# Altium schematic sheet 2_Wheels_H_Bridge.SchDoc: H Bridge
size A4; ApprovedBy: zac1; Author: mmb1; DrawnBy: mmb1; Engineer: mmb1; Organization: Berne University of Applied Sciences; Address1: School of Engineering and; Address2: Information Technology; Address3: Quellgasse 21; Address4: CH-2501 Biel; Revision: 1.0; SheetNumber: 4; SheetTotal: 6
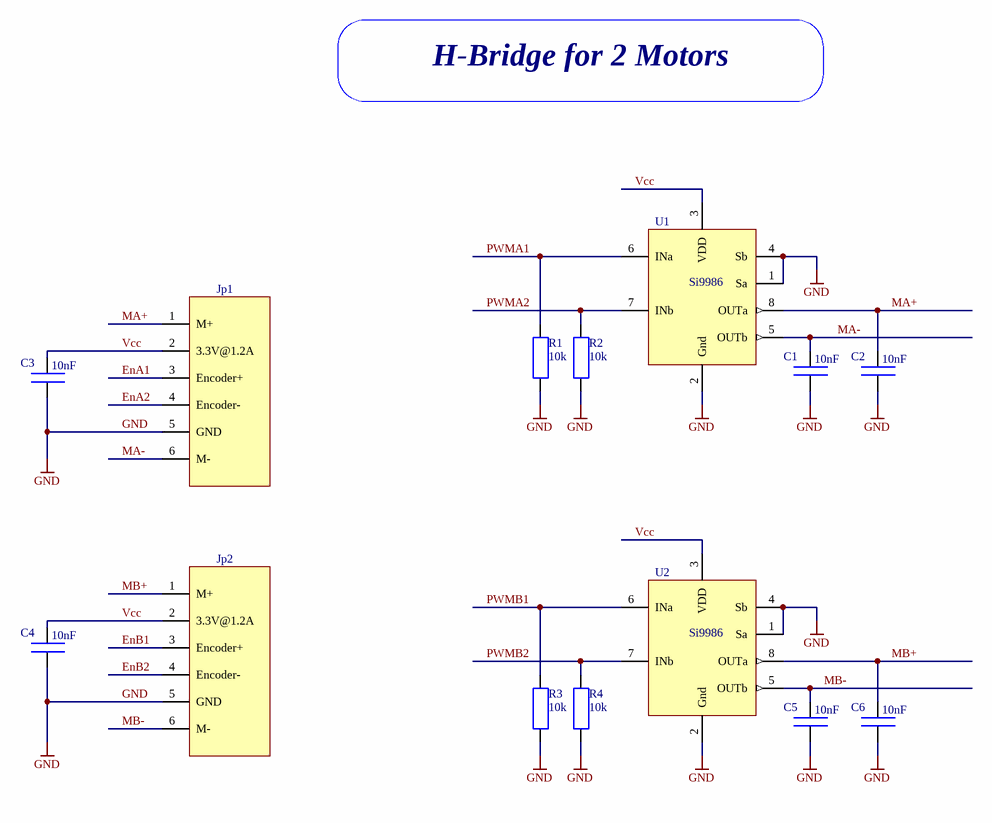
[diagram p0: 2_Wheels_H_Bridge.SchDoc]

## Parts
C1  10nF  [1608[0603]]
C2  10nF  [1608[0603]]
C3  10nF  [1608[0603]]
C4  10nF  [1608[0603]]
C5  10nF  [1608[0603]]
C6  10nF  [1608[0603]]
Jp1  (no value)  [New connector]
Jp2  (no value)  [New connector]
R1  10k  [1608[0603]]
R2  10k  [1608[0603]]
R3  10k  [1608[0603]]
R4  10k  [1608[0603]]
U1  Si9986  [Si9986]
U2  Si9986  [Si9986]

## Nets
GND: C1.1(J1) C2.1(J1) C3.1(J1) C4.1(J1) C5.1(J1) C6.1(J1) Jp1.5(GND) Jp2.5(GND) R1.1(J1) R2.1(J1) R3.1(J1) R4.1(J1) U1.1(Sa) U1.2(Gnd) U1.4(Sb) U2.1(Sa) U2.2(Gnd) U2.4(Sb)
EnA1: Jp1.3(Encoder+)
EnA2: Jp1.4(Encoder-)
EnB1: Jp2.3(Encoder+)
EnB2: Jp2.4(Encoder-)
MA+: C2.2(J2) Jp1.1(M+) U1.8(OUTa)
MA-: C1.2(J2) Jp1.6(M-) U1.5(OUTb)
MB+: C6.2(J2) Jp2.1(M+) U2.8(OUTa)
MB-: C5.2(J2) Jp2.6(M-) U2.5(OUTb)
PWMA1: R1.2(J2) U1.6(INa)
PWMA2: R2.2(J2) U1.7(INb)
PWMB1: R3.2(J2) U2.6(INa)
PWMB2: R4.2(J2) U2.7(INb)
Vcc: C3.2(J2) C4.2(J2) Jp1.2(3.3V@1.2A) Jp2.2(3.3V@1.2A) U1.3(VDD) U2.3(VDD)

## Notes on the sheet
- H-Bridge for 2 Motors
- Title:
- Size:
- Date:
- A4_L
- Author:
- Time:
- Revision:
- Sheet
- of
- File:

## Library data of the parts
C1-C6 = CAP: Capacitor; Manufacturer: AVX; Part Number: 06035C103KAT2A; Value: 10nF 0603; Currency: CHF; Packaging unit: 10; Part Type: 10nF; Distributor: Farnell; Distributor Number: 1327 675; Price: 0.07; RoHS: yes
Jp1 Jp2 = NEW CONNECTOR: Manufacturer: AMP; Part Number: 1241050-3; Value: Header 2x3,smt; Currency: CHF; Packaging unit: 1; Distributor: Farnell; Distributor Number: 9689 567; RoHS: yes; Price: 1.5
R1-R4 = RES: Resistance; Manufacturer: Multicomp; Part Number: MC 0.063W 0603 1% 10K; Value: 10k 0603; Currency: CHF; Packaging unit: 50; Part Type: 10k; Distributor: Farnell; Distributor Number: 9330 399; RoHS: X-yes; Price: 0.062
U1 U2 = Si9986: Manufacturer: Vishay; Part Number: SI9986DY-T1-E3; Currency: CHF; lead time: 2 Weeks; Packaging unit: 1; Value: Si9986; Distributor: Farnell; Distributor Number: 1199 224; RoHS: yes; Price: 6.6